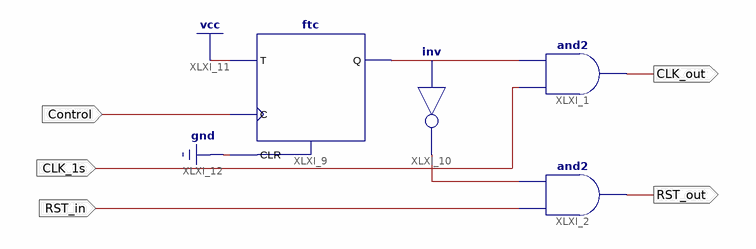
[diagram p0: schematic sheet 1]
// Xilinx ISE schematic ClockControl.sch (spartan6) as structural Verilog: 4 symbols, 5 ports
module ClockControl (
  input  Control,
  input  CLK_1s,
  input  RST_in,
  output CLK_out,
  output RST_out
);

  wire XLXN_1, XLXN_2;

  and XLXI_1 (CLK_out, CLK_1s, XLXN_1);
  ftc XLXI_9 (.C(Control), .CLR(1'b0), .T(1'b1), .Q(XLXN_1));
  not XLXI_10 (XLXN_2, XLXN_1);
  and XLXI_2 (RST_out, RST_in, XLXN_2);
endmodule
